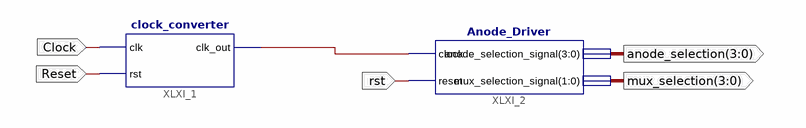
[diagram p0: schematic sheet 1]
// Xilinx ISE schematic Anode_Driver_schematic.sch (spartan3e) as structural Verilog: 2 symbols, 5 ports
module Anode_Driver_schematic (
  input  Clock,
  input  Reset,
  input  rst,
  output [3:0] anode_selection,
  output [3:0] mux_selection
);

  wire XLXN_4;

  clock_converter XLXI_1 (.clk(Clock), .rst(Reset), .clk_out(XLXN_4));
  Anode_Driver XLXI_2 (
    .clock(XLXN_4), .reset(rst), .anode_selection_signal(anode_selection),
    .mux_selection_signal(mux_selection));
endmodule
